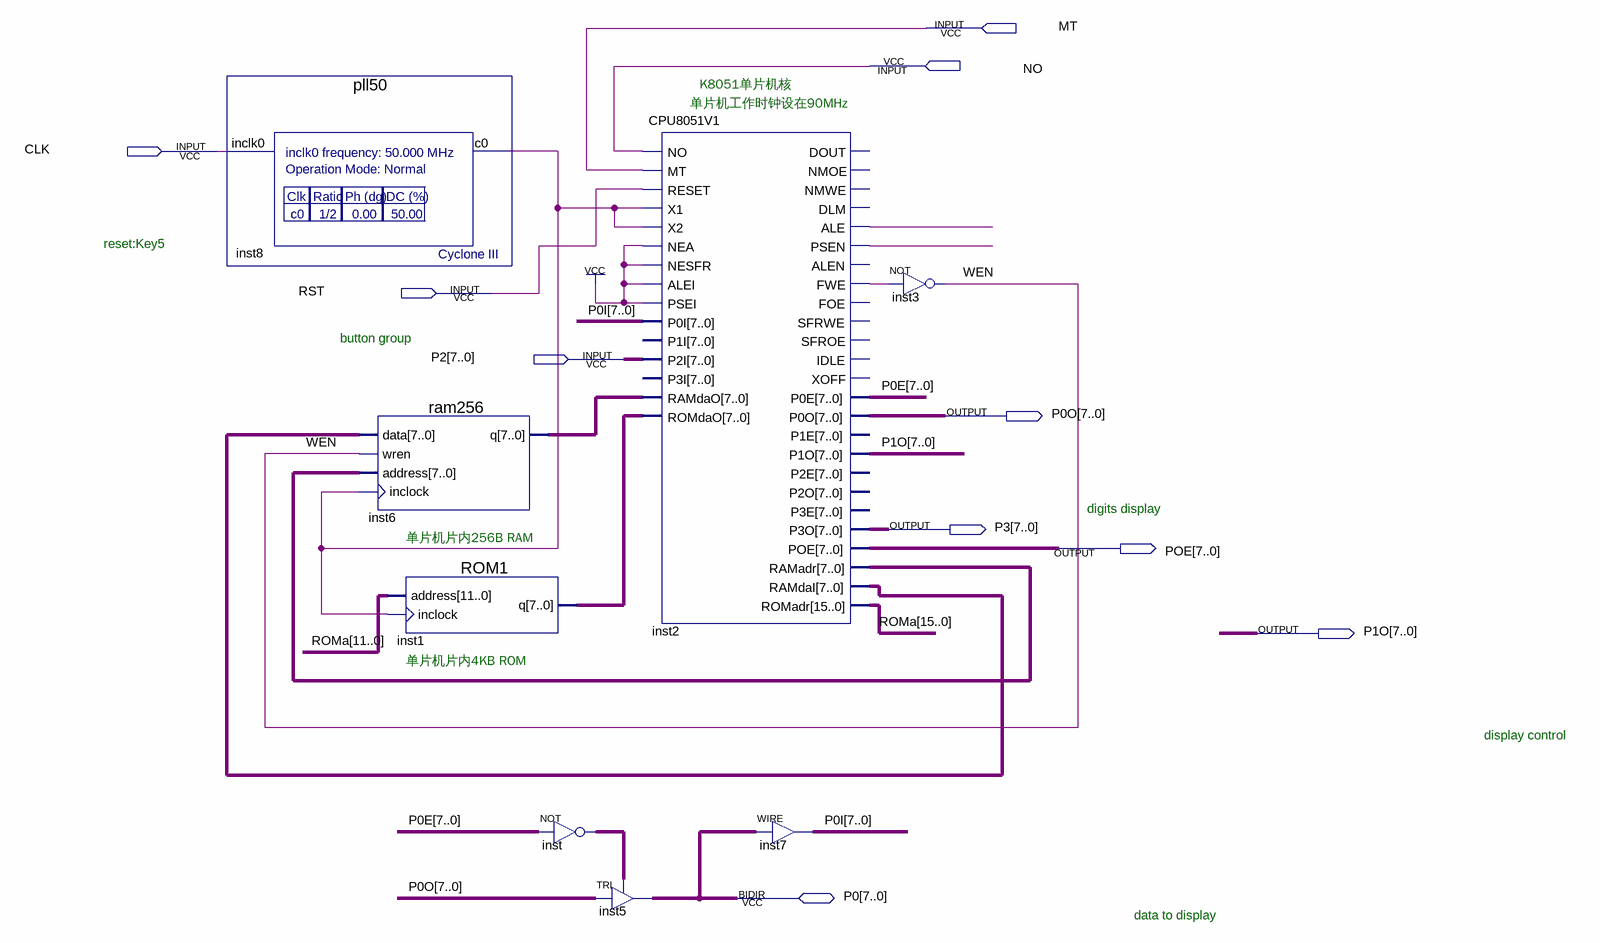
[diagram p0: schematic sheet]
// Quartus schematic MCU8951.bdf as structural Verilog: 8 symbols, 10 pins
module MCU8951 (
  input  MT,
  input  NO,
  input  CLK,
  input  RST,
  input  [7:0] P2,
  inout  [7:0] P0,
  output [7:0] P0O,
  output [7:0] P3,
  output [7:0] POE,
  output [7:0] P1O
);

  wire inst2_ale, inst2_fwe, inst2_psen, inst8_c0, WEN;
  wire [7:0] inst1_q, inst2_ramadr, inst2_ramdai, inst6_q, inst_out, P0E, P0I;
  wire [15:0] ROMa;

  pll50 inst8 (.inclk0(CLK), .c0(inst8_c0));
  ram256 inst6 (.data(inst2_ramdai), .wren(WEN), .address(inst2_ramadr), .inclock(inst8_c0), .q(inst6_q));
  ROM1 inst1 (.address(ROMa[11:0]), .inclock(inst8_c0), .q(inst1_q));
  assign inst_out = ~P0E;  // NOT inst, 8 bits wide
  TRI inst5[7:0] (.IN(P0O), .OE(inst_out), .OUT(P0));
  CPU8051V1 inst2 (
    .NO(NO), .MT(MT), .RESET(RST), .X1(inst8_c0), .X2(inst8_c0), .NEA(1'b1), .NESFR(1'b1), .ALEI(1'b1),
    .PSEI(1'b1), .P0I(P0I), .P2I(P2), .RAMdaO(inst6_q), .ROMdaO(inst1_q), .ALE(inst2_ale), .PSEN(inst2_psen),
    .FWE(inst2_fwe), .P0E(P0E), .P0O(P0O), .P1O(P1O), .P3O(P3), .POE(POE), .RAMadr(inst2_ramadr),
    .RAMdaI(inst2_ramdai), .ROMadr(ROMa));  // open: P1I, P3I, DOUT, NMOE, NMWE, DLM, ALEN, FOE, SFRWE, SFROE, IDLE, XOFF, P1E, P2E, P2O, P3E
  assign P0I = P0;  // WIRE inst7
  not inst3 (WEN, inst2_fwe);

  // Notes on the sheet:
  //   K8051单片机核
  //   单片机工作时钟设在90MHz
  //   reset:Key5
  //   button group
  //   digits display
  //   单片机片内256B RAM
  //   单片机片内4KB ROM
  //   display control
  //   data to display
endmodule
